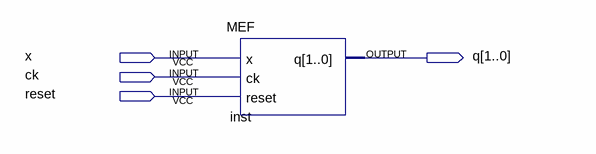
[diagram p0: schematic sheet]
// Quartus schematic MFE_symbol.bdf as structural Verilog: 1 symbols, 4 pins
module MFE_symbol (
  input  x,
  input  ck,
  input  reset,
  output [1:0] q
);

  MEF inst (.x(x), .ck(ck), .reset(reset), .q(q));
endmodule
